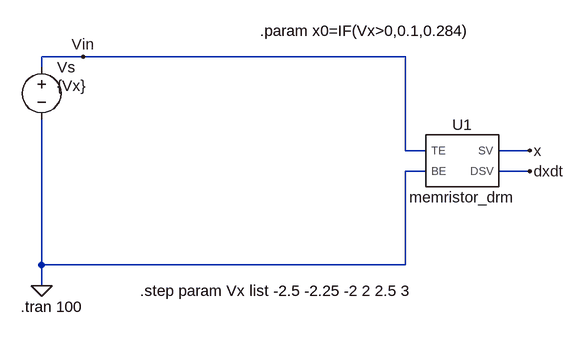
[diagram p0: schematic mem_drm.asc]
mem_drm.asc, the LTspice schematic file:
Version 4
SHEET 1 1352 680
WIRE -144 -160 -208 -160
WIRE 352 -160 -144 -160
WIRE -208 -144 -208 -160
WIRE 352 -16 352 -160
WIRE 384 -16 352 -16
WIRE 544 -16 496 -16
WIRE 384 16 352 16
WIRE 544 16 496 16
WIRE -208 160 -208 -64
WIRE 352 160 352 16
WIRE 352 160 -208 160
WIRE -208 192 -208 160
FLAG -208 192 0
FLAG 544 -16 x
FLAG 544 16 dxdt
FLAG -144 -160 Vin
SYMBOL voltage -208 -160 R0
WINDOW 123 0 0 Left 0
WINDOW 39 0 0 Left 0
WINDOW 3 24 44 Left 2
SYMATTR Value {Vx}
SYMATTR InstName Vs
SYMBOL memristor_drm 432 0 R0
SYMATTR InstName U1
TEXT -56 200 Left 2 !.step param Vx list -2.5 -2.25 -2 2 2.5 3
TEXT 128 -200 Left 2 !.param x0=IF(Vx>0,0.1,0.284)
TEXT -240 224 Left 2 !.tran 100

The netlist it stands for:
* mem_drm.asc
Vs Vin 0 {Vx}
XU1 Vin 0 x dxdt memristor_drm  ; pins TE BE SV DSV
.step param Vx list -2.5 -2.25 -2 2 2.5 3
.param x0=IF(Vx>0,0.1,0.284)
.tran 100
.lib memristor_drm.cir
.backanno
.end